# Altium schematic sheet T12.SchDoc
size A2
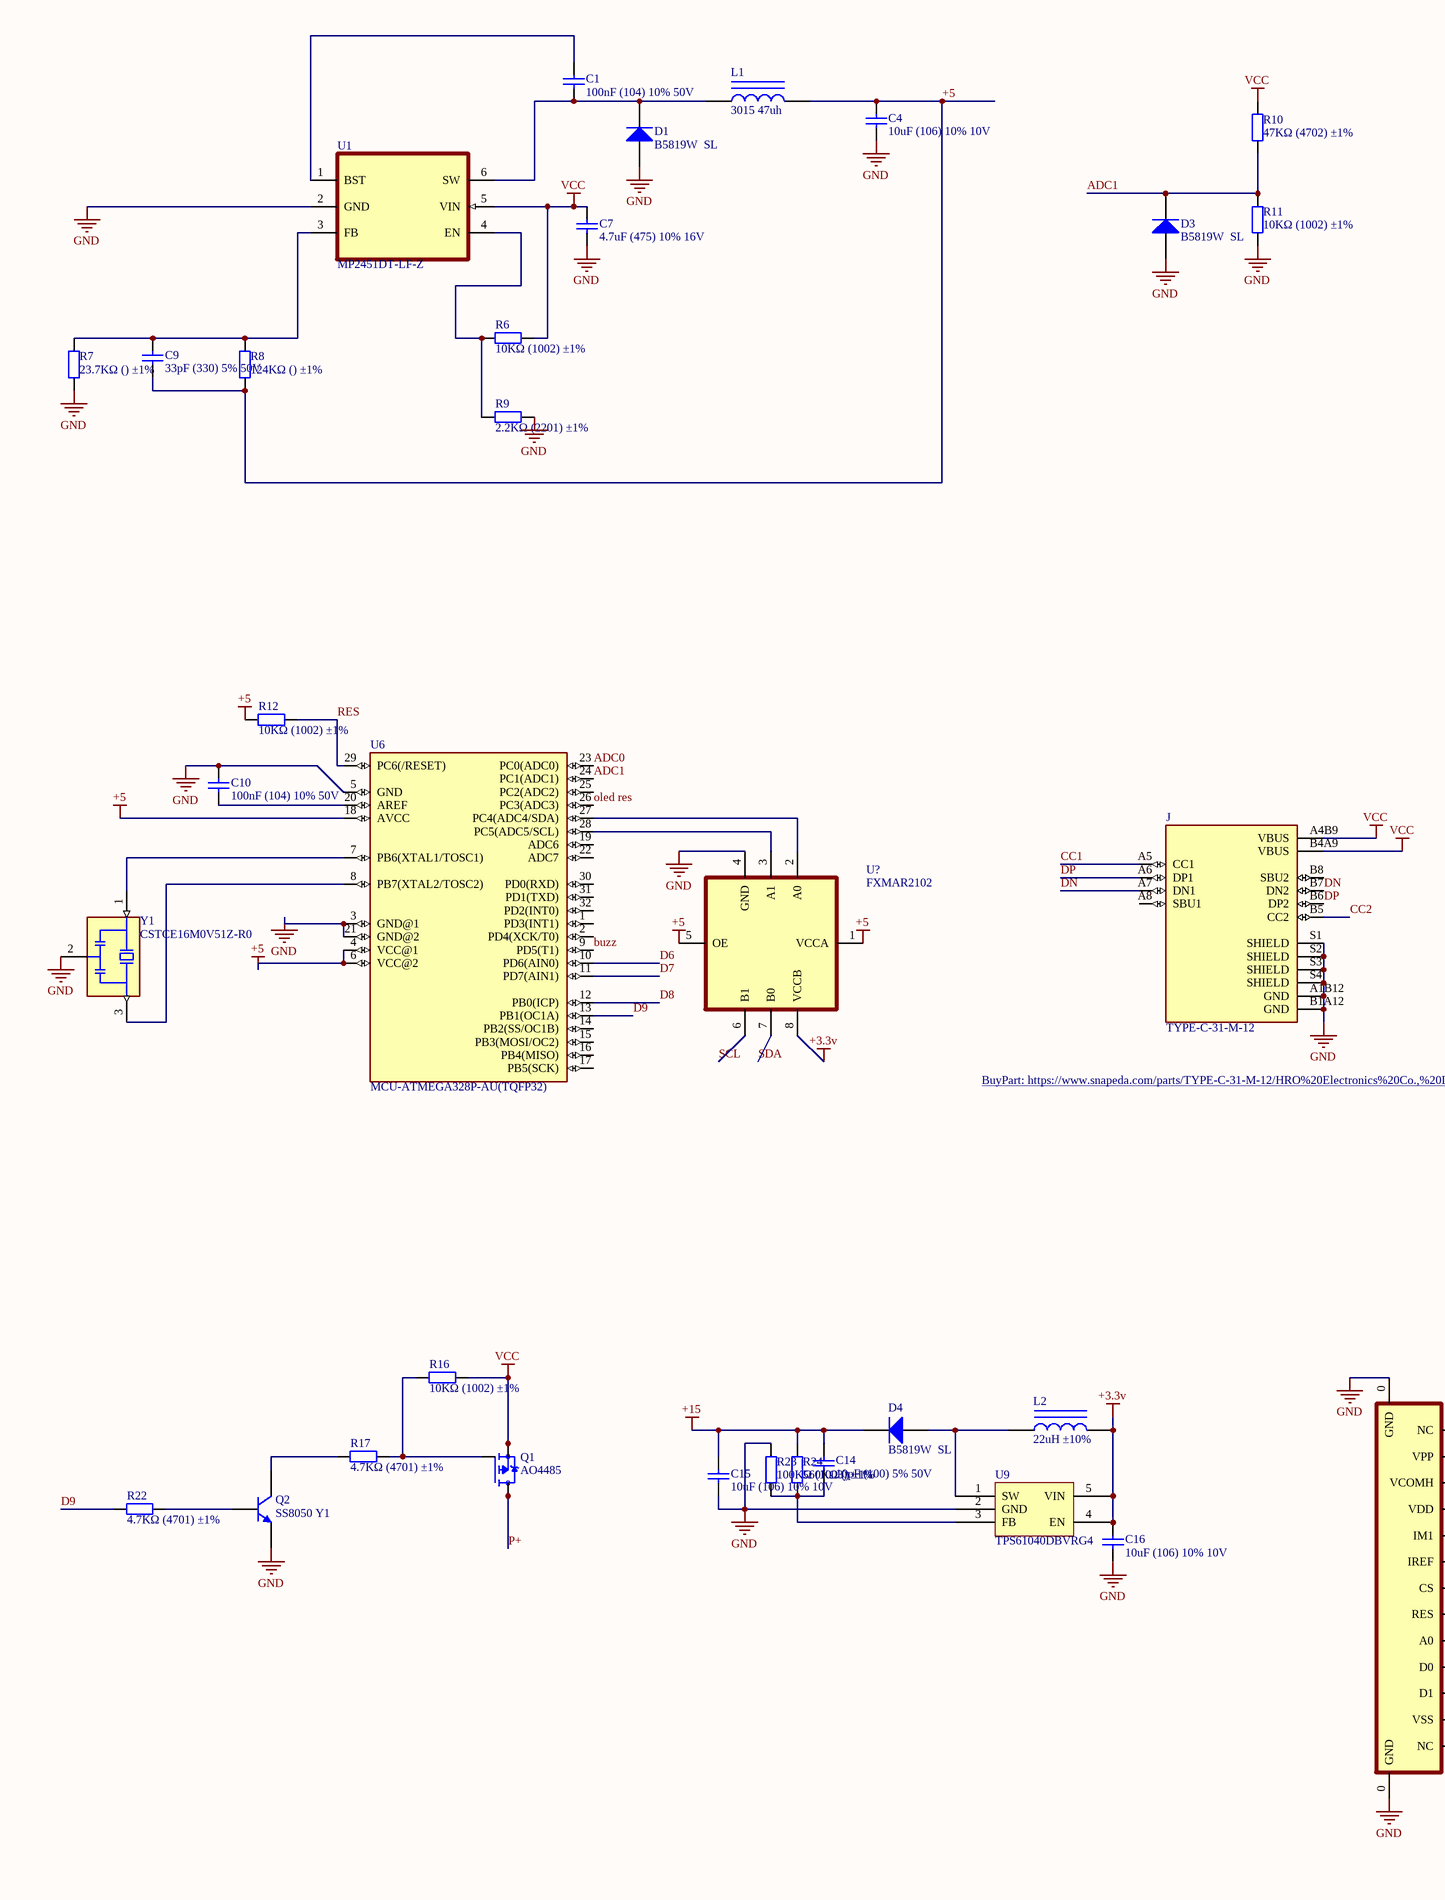
[diagram p0: T12.SchDoc, left]
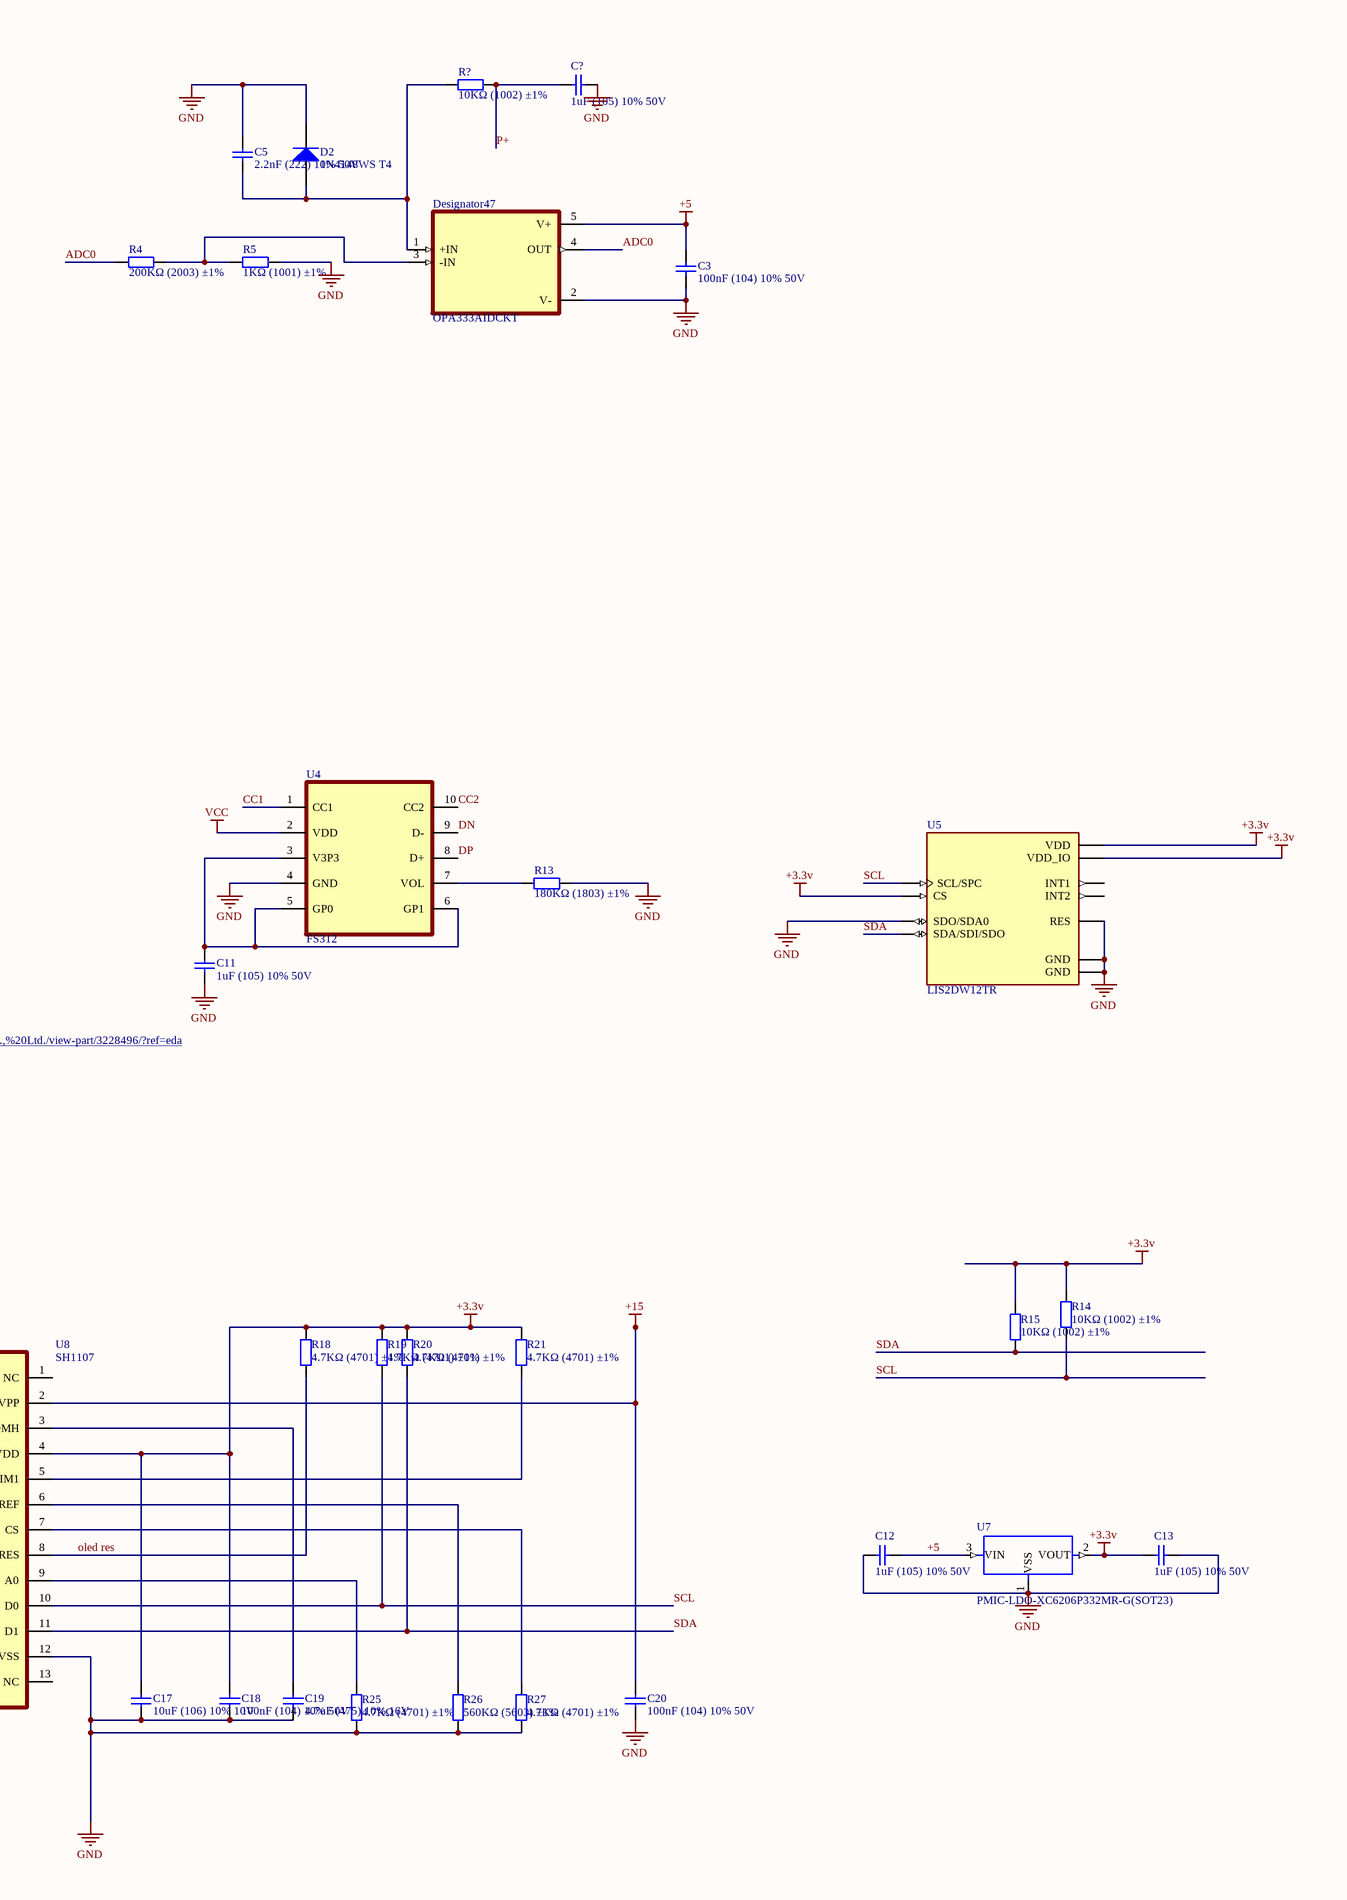
[diagram p1: T12.SchDoc, right]

## Parts
C1  100nF (104) 10% 50V  [0603_C]
C3  100nF (104) 10% 50V  [0603_C]
C4  10uF (106) 10% 10V  [0603_C]
C5  2.2nF (222) 10% 50V  [0603_C]
C7  4.7uF (475) 10% 16V  [0603_C]
C9  33pF (330) 5% 50V  [0603_C]
C10  100nF (104) 10% 50V  [0603_C]
C11  1uF (105) 10% 50V  [0603_C]
C12  1uF (105) 10% 50V  [0603_C]
C13  1uF (105) 10% 50V  [0603_C]
C14  10pF (100) 5% 50V  [0603_C]
C15  10uF (106) 10% 10V  [0603_C]
C16  10uF (106) 10% 10V  [0603_C]
C17  10uF (106) 10% 10V  [0603_C]
C18  100nF (104) 10% 50V  [0603_C]
C19  4.7uF (475) 10% 16V  [0603_C]
C20  100nF (104) 10% 50V  [0603_C]
C?  1uF (105) 10% 50V  [0603_C]
D1  B5819W  SL  [SOD-123]
D2  1N4148WS T4  [SOD-323]
D3  B5819W  SL  [SOD-123]
D4  B5819W  SL  [SOD-123]
Designator47  OPA333AIDCKT  [SOT65P210X110-5N]
J  TYPE-C-31-M-12  [HRO_TYPE-C-31-M-12]
L1  3015 47uh  [0603_L]
L2  22uH ±10%  [0603_L]
Q1  AO4485  [SOIC127P600X175-8N]
Q2  SS8050 Y1  [SOT-23(SOT-23-3)]
R4  200KΩ (2003) ±1%  [0603_R]
R5  1KΩ (1001) ±1%  [0603_R]
R6  10KΩ (1002) ±1%  [0603_R]
R7  23.7KΩ () ±1%  [0603_R]
R8  124KΩ () ±1%  [0603_R]
R9  2.2KΩ (2201) ±1%  [0603_R]
R10  47KΩ (4702) ±1%  [0603_R]
R11  10KΩ (1002) ±1%  [0603_R]
R12  10KΩ (1002) ±1%  [0603_R]
R13  180KΩ (1803) ±1%  [0603_R]
R14  10KΩ (1002) ±1%  [0603_R]
R15  10KΩ (1002) ±1%  [0603_R]
R16  10KΩ (1002) ±1%  [0603_R]
R17  4.7KΩ (4701) ±1%  [0603_R]
R18  4.7KΩ (4701) ±1%  [0603_R]
R19  4.7KΩ (4701) ±1%  [0603_R]
R20  4.7KΩ (4701) ±1%  [0603_R]
R21  4.7KΩ (4701) ±1%  [0603_R]
R22  4.7KΩ (4701) ±1%  [0603_R]
R23  100KΩ (1003) ±1%  [0603_R]
R24  560KΩ () ±1%  [0603_R]
R25  4.7KΩ (4701) ±1%  [0603_R]
R26  560KΩ (5603) ±1%  [0603_R]
R27  4.7KΩ (4701) ±1%  [0603_R]
R?  10KΩ (1002) ±1%  [0603_R]
U1  MP2451DT-LF-Z  [SOT-23-6_L2.9-W1.6-P0.95-LS2.8-BR]
U4  FS312  [FS312]
U5  LIS2DW12TR  [LGA12R50P4X4_200X200X70]
U6  MCU-ATMEGA328P-AU(TQFP32)  [TQFP32-0.8-7X7MM]
U7  PMIC-LDO-XC6206P332MR-G(SOT23)  [SOT-23]
U8  SH1107  [FH35C-13S]
U9  TPS61040DBVRG4  [SOT-23-5]
U?  FXMAR2102  [SOT95P280X145-5N]
Y1  CSTCE16M0V51Z-R0  [OSC_CSTCE16M0V51Z-R0]

## Nets
+3.3v: C13.1 C16.2 C17.2 C18.2 L2.2 R14.2 R15.2 R18.2 R19.2 R20.2 R21.2 U5.2(CS) U5.9(VDD) U5.10(VDD_IO) U7.2(VOUT) U8.4(VDD) U9.4(EN) U9.5(VIN) U?.8(VCCB)
+5: C3.2 C4.2 C9.1 C12.2 Designator47.5(V+) L1.2 R8.1 R12.1 U6.4(VCC@1) U6.6(VCC@2) U6.18(AVCC) U7.3(VIN) U?.1(VCCA) U?.5(OE)
+15: C14.2 C15.2 C20.2 D4.2(K) R24.2 U8.2(VPP)
GND: C3.1 C4.1 C5.2 C7.1 C10.2 C11.1 C12.1 C13.2 C15.1 C16.1 C17.1 C18.1 C19.1 C20.1 C?.2 D1.1(A) D2.2(K) D3.1(A) Designator47.2(V-) J.A1B12(GND) J.B1A12(GND) J.S1(SHIELD) J.S2(SHIELD) J.S3(SHIELD) J.S4(SHIELD) Q2.2(E) R5.2 R7.1 R9.2 R11.1 R13.2 R23.2 R25.1 R26.1 R27.1 U1.2(GND) U4.4(GND) U5.3(SDO/SDA0) U5.6(GND) U5.7(RES) U5.8(GND) U6.3(GND@1) U6.5(GND) U6.21(GND@2) U7.1(VSS) U8.0(GND) U8.12(VSS) U9.2(GND) U?.4(GND) Y1.2(GND)
VCC: C7.2 J.A4B9(VBUS) J.B4A9(VBUS) Q1.1(S) Q1.2(S) Q1.3(S) R6.2 R10.2 R16.2 U1.5(VIN) U4.2(VDD)
ADC0: Designator47.4(OUT) R4.1 U6.23(PC0(ADC0))
ADC1: D3.2(K) R10.1 R11.2 U6.24(PC1(ADC1))
buzz: U6.9(PD5(T1))
CC1: J.A5(CC1) U4.1(CC1)
CC2: J.B5(CC2) U4.10(CC2)
D6: U6.10(PD6(AIN0))
D7: U6.11(PD7(AIN1))
D8: U6.12(PB0(ICP))
D9: R22.1 U6.13(PB1(OC1A))
DN: J.A7(DN1) J.B7(DN2) U4.9(D-)
DP: J.A6(DP1) J.B6(DP2) U4.8(D+)
oled res: R18.1 U6.26(PC3(ADC3)) U8.8(RES)
P+: C?.1 Q1.5(D) Q1.6(D) Q1.7(D) Q1.8(D) R?.2
RES: R12.2 U6.29(PC6(/RESET))
SCL: R14.1 R19.1 U5.1(SCL/SPC) U8.10(D0) U?.6(B1)
SDA: R15.1 R20.1 U5.4(SDA/SDI/SDO) U8.11(D1) U?.7(B0)
NetC1_1: C1.1 D1.2(K) L1.1 U1.6(SW)
NetC1_2: C1.2 U1.1(BST)
NetC5_1: C5.1 D2.1(A) Designator47.1(+IN) R?.1
NetC9_2: C9.2 R7.2 R8.2 U1.3(FB)
NetC10_1: C10.1 U6.20(AREF)
NetC11_2: C11.2 U4.3(V3P3) U4.5(GP0) U4.6(GP1)
NetC14_1: C14.1 R23.1 R24.1 U9.3(FB)
NetC19_2: C19.2 U8.3(VCOMH)
NetD4_1: D4.1(A) L2.1 U9.1(SW)
NetDesignator47_3: Designator47.3(-IN) R4.2 R5.1
NetQ1_4: Q1.4(G) R16.1 R17.2
NetQ2_1: Q2.1(B) R22.2
NetQ2_3: Q2.3(C) R17.1
NetR6_1: R6.1 R9.1 U1.4(EN)
NetR13_1: R13.1 U4.7(VOL)
NetR21_1: R21.1 U8.5(IM1)
NetR25_2: R25.2 U8.9(A0)
NetR26_2: R26.2 U8.6(IREF)
NetR27_2: R27.2 U8.7(CS)
NetU6_7: U6.7(PB6(XTAL1/TOSC1)) Y1.1(IN)
NetU6_8: U6.8(PB7(XTAL2/TOSC2)) Y1.3(OUT)
NetU6_27: U6.27(PC4(ADC4/SDA)) U?.2(A0)
NetU6_28: U6.28(PC5(ADC5/SCL)) U?.3(A1)

Not connected (* = marked no-connect by the designer): J A8(SBU1) B8(SBU2); U5 11(INT2) 12(INT1); U6 1(PD3(INT1)) 2(PD4(XCK/T0)) 14(PB2(SS/OC1B)) 15(PB3(MOSI/OC2)) 16(PB4(MISO)) 17(PB5(SCK)) 19(ADC6) 22(ADC7) 25(PC2(ADC2)) 30(PD0(RXD)) 31(PD1(TXD)) 32(PD2(INT0)); U8 1(NC) 13(NC)

## Library data of the parts
C1 C3 C10 C18 C20 = 0603 100nF (104) 10% 50V: 贴片电容; ComponentLink1Description: 供应商链接; ComponentLink1URL: http://www.szlcsc.com/product/details_15331.html; Package: 0603; Supplier: LC; SuppliersPartNumber: C14663
C4 C15-C17 = 0603 10uF (106) 10% 10V: 贴片电容; ComponentLink1Description: 供应商链接; ComponentLink1URL: http://www.szlcsc.com/product/details_20411.html; Package: 0603; Supplier: LC; SuppliersPartNumber: C19702
C5 = 0603 2.2nF (222) 10% 50V: 贴片电容; ComponentLink1Description: 供应商链接; ComponentLink1URL: http://www.szlcsc.com/product/details_1956.html; Package: 0603; Supplier: LC; SuppliersPartNumber: C1604
C7 C19 = 0603 4.7uF (475) 10% 16V: 贴片电容; ComponentLink1Description: 供应商链接; ComponentLink1URL: http://www.szlcsc.com/product/details_20375.html; Package: 0603; Supplier: LC; SuppliersPartNumber: C19666
C9 = 0603 33pF (330) 5% 50V: 贴片电容; ComponentLink1Description: 供应商链接; ComponentLink1URL: http://www.szlcsc.com/product/details_2015.html; Package: 0603; Supplier: LC; SuppliersPartNumber: C1663
C11-C13 C? = 0603 1uF (105) 10% 50V: 贴片电容; ComponentLink1Description: 供应商链接; ComponentLink1URL: http://www.szlcsc.com/product/details_16531.html; Package: 0603; Supplier: LC; SuppliersPartNumber: C15849
C14 = 0603 10pF (100) 5% 50V: 贴片电容; ComponentLink1Description: 供应商链接; ComponentLink1URL: http://www.szlcsc.com/product/details_1986.html; Package: 0603; Supplier: LC; SuppliersPartNumber: C1634
D1 D3 D4 = SOD-123 B5819W  SL: 肖特基二极管; ComponentLink1Description: 供应商链接; ComponentLink1URL: http://www.szlcsc.com/product/details_9093.html; Package: SOD-123; Supplier: LC; SuppliersPartNumber: C8598
D2 = SOD-323 1N4148WS T4: 二极管; ComponentLink1Description: 供应商链接; ComponentLink1URL: http://www.szlcsc.com/product/details_2485.html; Package: SOD-323; Supplier: LC; SuppliersPartNumber: C2128
Designator47 = OPA333AIDCKT: MF: {'manufacturer': u'Texas Instruments'}; MP: OPA333AIDCKT; Package: None; Price: None; Availability: Unavailable; Value: *
J = TYPE-C-31-M-12: USB Connectors 24 Receptacle 1 8.94*7.3mm RoHS; MF: HRO Electronics Co., Ltd.; Value: *; SnapEDA_Link: https://www.snapeda.com/parts/TYPE-C-31-M-12/HRO%20Electronics%20Co.,%20Ltd./view-part/3228496/?ref=snap; Package: Package; MP: TYPE-C-31-M-12; Price: None; Availability: Unavailable; BuyPart: https://www.snapeda.com/parts/TYPE-C-31-M-12/HRO%20Electronics%20Co.,%20Ltd./view-part/3228496/?ref=eda
L1 = 0603 33nH 5%: 贴片电感; ComponentLink1Description: 供应商链接; ComponentLink1URL: http://www.szlcsc.com/product/details_36021.html; Package: 0603; Supplier: LC; SuppliersPartNumber: C35050
L2 = 0603 4.7uH 10%: 贴片电感; ComponentLink1Description: 供应商链接; ComponentLink1URL: http://www.szlcsc.com/product/details_1386.html; Package: 0603; Supplier: LC; SuppliersPartNumber: C1034
Q1 = AO4485: Transistor: P-MOSFET; unipolar; -40V; -8A; 1.1W; SO8; MF: {'manufacturer': u'Alpha '}; Availability: Unavailable; Price: None; Value: *; MP: AO4485; Package: None
Q2 = SOT-23 SS8050 Y1: 三极管; ComponentLink1Description: 供应商链接; ComponentLink1URL: http://www.szlcsc.com/product/details_2507.html; Package: SOT-23; Supplier: LC; SuppliersPartNumber: C2150
R4 = 0603 200KΩ (2003) 1%: 贴片电阻; ComponentLink1Description: 供应商链接; ComponentLink1URL: http://www.szlcsc.com/product/details_26554.html; Package: 0603; Supplier: LC; SuppliersPartNumber: C25811
R5 = 0603 1KΩ (1001) 1%: 贴片电阻; ComponentLink1Description: 供应商链接; ComponentLink1URL: http://www.szlcsc.com/product/details_21904.html; Package: 0603; Supplier: LC; SuppliersPartNumber: C21190
R6 R7 R11 R12 R14-R16 R24 R? = 0603 10KΩ (1002) 1%: 贴片电阻; ComponentLink1Description: 供应商链接; ComponentLink1URL: http://www.szlcsc.com/product/details_26547.html; Package: 0603; Supplier: LC; SuppliersPartNumber: C25804
R8 = 0603 62KΩ (6202) 1%: 贴片电阻; ComponentLink1Description: 供应商链接; ComponentLink1URL: http://www.szlcsc.com/product/details_23948.html; Package: 0603; Supplier: LC; SuppliersPartNumber: C23221
R9 = 0603 2.2KΩ (2201) 1%: 贴片电阻; ComponentLink1Description: 供应商链接; ComponentLink1URL: http://www.szlcsc.com/product/details_4597.html; Package: 0603; Supplier: LC; SuppliersPartNumber: C4190
R10 = 0603 47KΩ (4702) 1%: 贴片电阻; ComponentLink1Description: 供应商链接; ComponentLink1URL: http://www.szlcsc.com/product/details_26562.html; Package: 0603; Supplier: LC; SuppliersPartNumber: C25819
R13 = 0603 180KΩ (1803) 1%: 贴片电阻; ComponentLink1Description: 供应商链接; ComponentLink1URL: http://www.szlcsc.com/product/details_23554.html; Package: 0603; Supplier: LC; SuppliersPartNumber: C22827
R17-R22 R25 R27 = 0603 4.7KΩ (4701) 1%: 贴片电阻; ComponentLink1Description: 供应商链接; ComponentLink1URL: http://www.szlcsc.com/product/details_23889.html; Package: 0603; Supplier: LC; SuppliersPartNumber: C23162
R23 = 0603 100KΩ (1003) 1%: 贴片电阻; ComponentLink1Description: 供应商链接; ComponentLink1URL: http://www.szlcsc.com/product/details_26546.html; Package: 0603; Supplier: LC; SuppliersPartNumber: C25803
R26 = 0603 560KΩ (5603) 1%: 贴片电阻; ComponentLink1Description: 供应商链接; ComponentLink1URL: http://www.szlcsc.com/product/details_23930.html; Package: 0603; Supplier: LC; SuppliersPartNumber: C23203
U1 = MP2451DT-LF-Z: MF: {'manufacturer': u'Texas Instruments'}; MP: LP2985AIM5-5.0; Availability: Unavailable; Price: None; Package: None; Value: *
U4 = FS312: MF: {'manufacturer': u'Texas Instruments'}; MP: LP2985AIM5-5.0; Availability: Unavailable; Price: None; Package: None; Value: *
U5 = LIS2DW12TR: Mems Digital Output Motion Sensor; MF: {'manufacturer': u'STMicroelectronics'}; MP: LIS2DW12TR; Availability: Unavailable; Package: None; Value: *; Price: None
U6 = MCU-ATMEGA328P-AU(TQFP32): 310010049; MF: {'manufacturer': u'Microchip Technology'}; Availability: Unavailable; Price: None; Package: None; Value: *; MP: ATMEGA328P-AU
U7 = PMIC-LDO-XC6206P332MR-G(SOT23): 310030099; MF: {'manufacturer': u'Torex'}; Price: None; Package: None; Availability: Unavailable; MP: PMIC-LDO-XC6206P332MR-G(SOT23); Value: *
U8 = SH1107: MF: {'manufacturer': u'Texas Instruments'}; MP: LP2985AIM5-5.0; Availability: Unavailable; Price: None; Package: None; Value: *
U9 = TPS61040DBVRG4_[C7722]: DC-DC芯片; ComponentLink1Description: 供应商链接; ComponentLink1URL: http://www.szlcsc.com/product/details_8199.html; Package: SOT-23-5; Supplier: LC; SuppliersPartNumber: C7722
U? = FXMAR2102: MF: {'manufacturer': u'Texas Instruments'}; MP: LP2985AIM5-5.0; Availability: Unavailable; Price: None; Package: None; Value: *
Y1 = CSTCE16M0V51Z-R0: 20MHz Ceramic Resonator Built in Capacitor 15pF +/- 0.2% -40C - 125C Surface Mount; MF: {'manufacturer': u'Murata'}; Value: *; Package: None; Price: None; MP: CSTCE16M0V51Z-R0; Availability: Unavailable